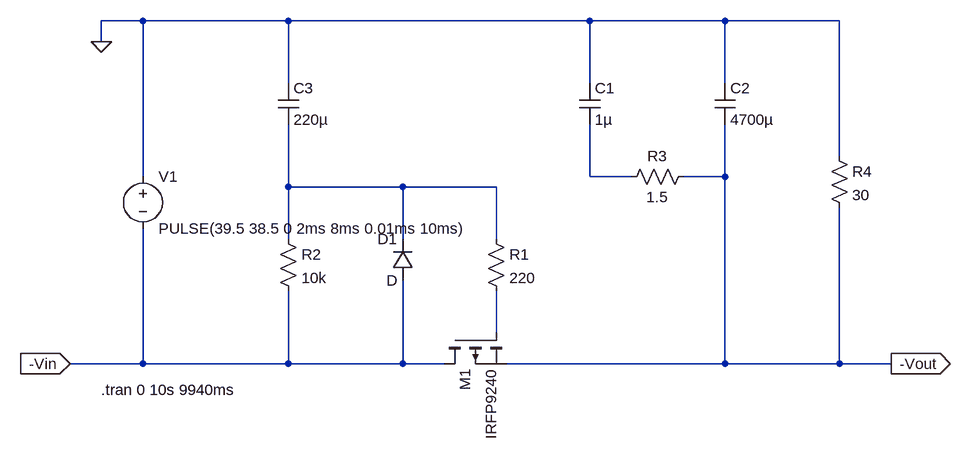
[diagram p0: schematic ripple_filter_neg_mosfet.asc]
ripple_filter_neg_mosfet.asc, the LTspice schematic file:
Version 4
SHEET 1 1068 680
WIRE -208 -464 -272 -464
WIRE 16 -464 -208 -464
WIRE 480 -464 16 -464
WIRE 688 -464 480 -464
WIRE 864 -464 688 -464
WIRE -272 -432 -272 -464
WIRE 16 -368 16 -464
WIRE 480 -368 480 -464
WIRE 688 -368 688 -464
WIRE 864 -256 864 -464
WIRE -208 -224 -208 -464
WIRE 480 -224 480 -304
WIRE 544 -224 480 -224
WIRE 688 -224 688 -304
WIRE 688 -224 624 -224
WIRE 16 -208 16 -304
WIRE 192 -208 16 -208
WIRE 336 -208 192 -208
WIRE 16 -128 16 -208
WIRE 192 -128 192 -208
WIRE 336 -128 336 -208
WIRE 336 16 336 -48
WIRE -208 64 -208 -144
WIRE -208 64 -320 64
WIRE 16 64 16 -48
WIRE 16 64 -208 64
WIRE 192 64 192 -64
WIRE 192 64 16 64
WIRE 256 64 192 64
WIRE 688 64 688 -224
WIRE 688 64 352 64
WIRE 864 64 864 -176
WIRE 864 64 688 64
WIRE 944 64 864 64
FLAG -272 -432 0
FLAG -320 64 -Vin
IOPIN -320 64 In
FLAG 944 64 -Vout
IOPIN 944 64 Out
SYMBOL pmos 256 16 M90
SYMATTR InstName M1
SYMATTR Value IRFP9240
SYMBOL res 320 -144 R0
SYMATTR InstName R1
SYMATTR Value 220
SYMBOL diode 208 -64 R180
WINDOW 0 24 64 Left 2
WINDOW 3 24 0 Left 2
SYMATTR InstName D1
SYMBOL res 0 -144 R0
SYMATTR InstName R2
SYMATTR Value 10k
SYMBOL cap 464 -368 R0
SYMATTR InstName C1
SYMATTR Value 1µ
SYMBOL res 640 -240 R90
WINDOW 0 0 56 VBottom 2
WINDOW 3 32 56 VTop 2
SYMATTR InstName R3
SYMATTR Value 1.5
SYMBOL cap 672 -368 R0
SYMATTR InstName C2
SYMATTR Value 4700µ
SYMBOL cap 0 -368 R0
SYMATTR InstName C3
SYMATTR Value 220µ
SYMBOL voltage -208 -240 R0
WINDOW 123 0 0 Left 0
WINDOW 39 0 0 Left 0
SYMATTR InstName V1
SYMATTR Value PULSE(39.5 38.5 0 2ms 8ms 0.01ms 10ms)
SYMBOL res 848 -272 R0
SYMATTR InstName R4
SYMATTR Value 30
TEXT -272 104 Left 2 !.tran 0 10s 9940ms

The netlist it stands for:
* ripple_filter_neg_mosfet.asc
M1 -Vin N003 -Vout -Vout IRFP9240
R1 N002 N003 220
D1 -Vin N002 D
R2 N002 -Vin 10k
C1 0 N001 1µ
R3 -Vout N001 1.5
C2 0 -Vout 4700µ
C3 0 N002 220µ
V1 0 -Vin PULSE(39.5 38.5 0 2ms 8ms 0.01ms 10ms)
R4 0 -Vout 30
.model D D
.lib standard.dio
.model NMOS NMOS
.model PMOS PMOS
.lib standard.mos
.tran 0 10s 9940ms
.backanno
.end